# EAGLE design switch_reed (EAGLE 6.6.0)
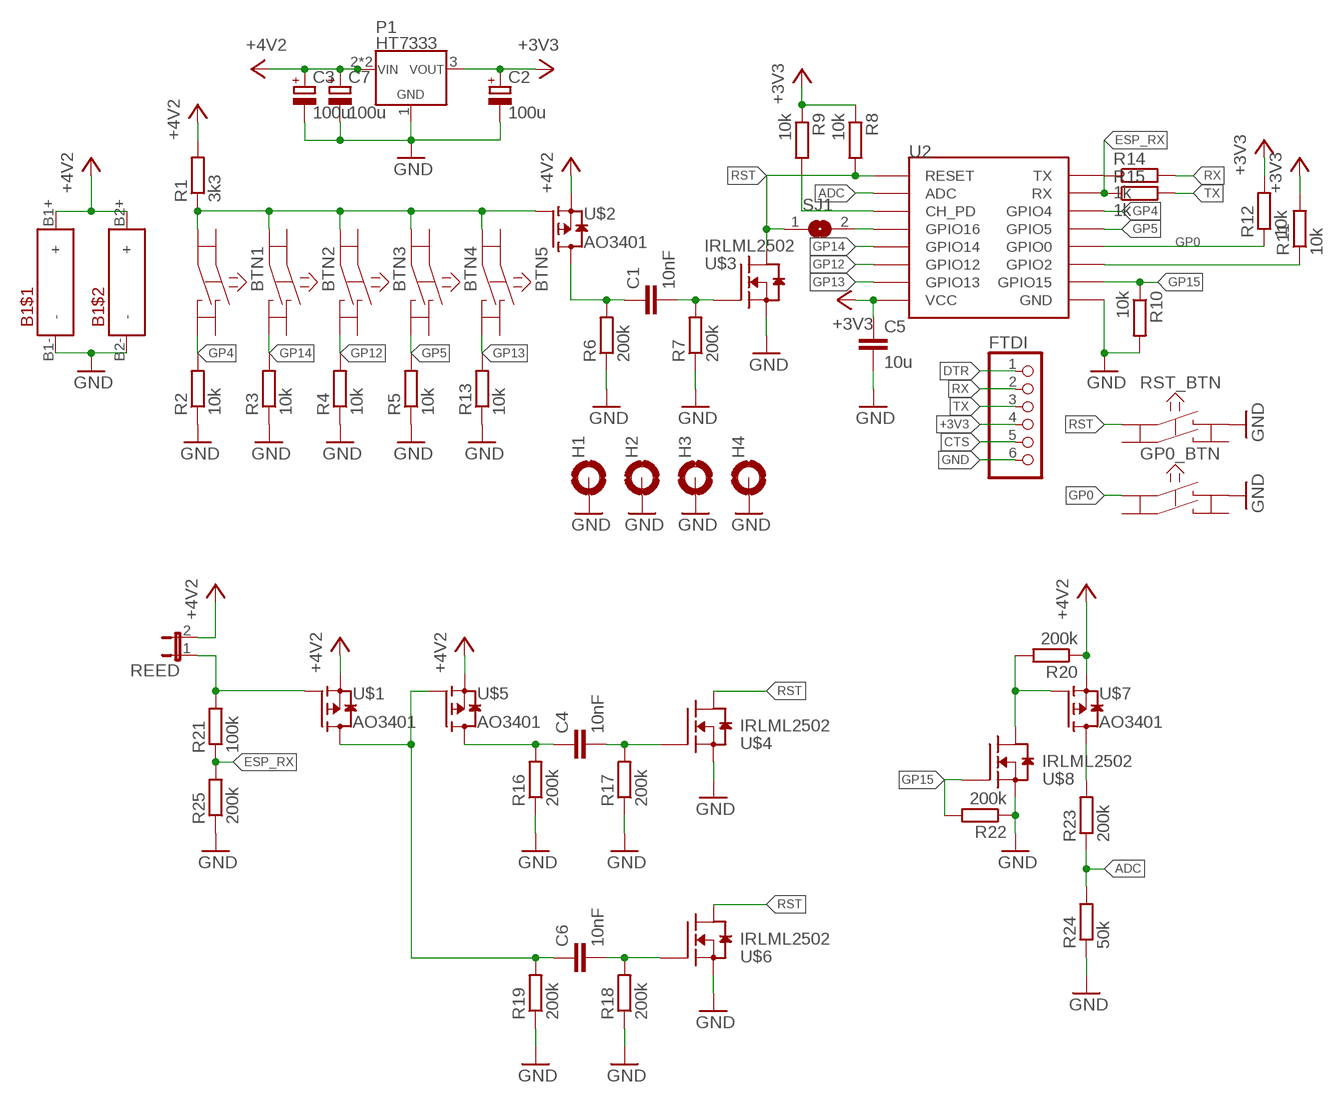
[diagram p0: schematic, sheet 1]

## Parts
B1  18650_2X  [18650_HOLDER]
BTN1  KSM611A  [KSM611A]
BTN2  KSM611A  [KSM611A]
BTN3  KSM611A  [KSM611A]
BTN4  KSM611A  [KSM611A]
BTN5  KSM611A  [KSM611A]
C1  10nF  C-EUC0805  [C0805]
C2  100u  CPOL-EUE5-8.5  [E5-8,5]
C3  100u  CPOL-EUE5-8.5  [E5-8,5]
C4  10nF  C-EUC0805  [C0805]
C5  10u  C-EUC1206  [C1206]
C6  10nF  C-EUC0805  [C0805]
C7  100u  CPOL-EUE5-8.5  [E5-8,5]
FTDI  PINHD-1X06_2.54-S  [1X06-S]
GP0_BTN  KSM611A  [KSM611A]
H1  MOUNT-PAD-ROUND3.2  [3,2-PAD]
H2  MOUNT-PAD-ROUND3.2  [3,2-PAD]
H3  MOUNT-PAD-ROUND3.2  [3,2-PAD]
H4  MOUNT-PAD-ROUND3.2  [3,2-PAD]
P1  HT7333  HT7333SOT89  [SOT89]
R1  3k3  R-EU_R0805  [R0805]
R2  10k  R-EU_R0805  [R0805]
R3  10k  R-EU_R0805  [R0805]
R4  10k  R-EU_R0805  [R0805]
R5  10k  R-EU_R0805  [R0805]
R6  200k  R-EU_R0805  [R0805]
R7  200k  R-EU_R0805  [R0805]
R8  10k  R-EU_R0805  [R0805]
R9  10k  R-EU_R0805  [R0805]
R10  10k  R-EU_R0805  [R0805]
R11  10k  R-EU_R0805  [R0805]
R12  10k  R-EU_R0805  [R0805]
R13  10k  R-EU_R0805  [R0805]
R14  1k  R-EU_R0805  [R0805]
R15  1k  R-EU_R0805  [R0805]
R16  200k  R-EU_R0805  [R0805]
R17  200k  R-EU_R0805  [R0805]
R18  200k  R-EU_R0805  [R0805]
R19  200k  R-EU_R0805  [R0805]
R20  200k  R-EU_R0805  [R0805]
R21  100k  R-EU_R0805  [R0805]
R22  200k  R-EU_R0805  [R0805]
R23  200k  R-EU_R0805  [R0805]
R24  50k  R-EU_R0805  [R0805]
R25  200k  R-EU_R0805  [R0805]
REED  JP1E  [JP1]
RST_BTN  KSM611A  [KSM611A]
SJ1  SJ  [SJ]
U2  ESP12SMD  [ESP12-SMD]
U$1  AO3401  P-CH_AO3401  [SOT23]
U$2  AO3401  P-CH_AO3401  [SOT23]
U$3  IRLML2502  N-CH_IRLML2502  [SOT23]
U$4  IRLML2502  N-CH_IRLML2502  [SOT23]
U$5  AO3401  P-CH_AO3401  [SOT23]
U$6  IRLML2502  N-CH_IRLML2502  [SOT23]
U$7  AO3401  P-CH_AO3401  [SOT23]
U$8  IRLML2502  N-CH_IRLML2502  [SOT23]

## Nets
+3V3: C2.+ C5.1 FTDI.4 P1.3(VOUT) R8.1 R9.1 R11.2 R12.2 U2.VCC
+5V: B1.B1+($1:+) B1.B2+($2:+) C3.+ C7.+ P1.2(VIN) P1.2@1(VIN) R1.2 R20.1 REED.2 U$1.2(S) U$2.2(S) U$5.2(S) U$7.2(S) ; supply symbol labelled +4V2
ADC: R23.1 R24.2 U2.ADC
CTS: FTDI.5
DTR: FTDI.1
ESP_RX: R15.1 R21.1 R25.2 U2.RXD0(RX)
GND: B1.B1-($1:-) B1.B2-($2:-) C2.- C3.- C5.2 C7.- FTDI.6 GP0_BTN.B H1.B3,2(MOUNT) H2.B3,2(MOUNT) H3.B3,2(MOUNT) H4.B3,2(MOUNT) P1.1(GND) R2.1 R3.1 R4.1 R5.1 R6.1 R7.1 R10.2 R13.1 R16.1 R17.1 R18.1 R19.1 R22.1 R24.1 R25.1 RST_BTN.B U2.GND U$3.2(S) U$4.2(S) U$6.2(S) U$8.2(S)
GP0: GP0_BTN.A R12.1 U2.GPIO0
GP4: BTN1.D R2.2 U2.GPIO4
GP5: BTN4.D R5.2 U2.GPIO5
GP12: BTN3.D R4.2 U2.GPIO12
GP13: BTN5.D R13.2 U2.GPIO13
GP14: BTN2.D R3.2 U2.GPIO14
GP15: R10.1 R22.2 U2.GPIO15 U$8.1(G)
N$1: SJ1.2 U2.GPIO16
N$2: R9.2 U2.CH_PD
N$3: C1.2 R7.2 U$3.1(G)
N$5: R11.1 U2.GPIO2
N$6: R14.1 U2.TXD0(TX)
N$7: C1.1 R6.2 U$2.3(D)
N$8: BTN1.C BTN2.C BTN3.C BTN4.C BTN5.C R1.1 U$2.1(G)
N$11: C6.1 R19.2 U$1.3(D) U$5.1(G)
N$12: C4.1 R16.2 U$5.3(D)
N$13: C4.2 R17.2 U$4.1(G)
N$14: C6.2 R18.2 U$6.1(G)
N$16: R20.2 U$7.1(G) U$8.3(D)
N$17: R23.2 U$7.3(D)
N$18: R21.2 REED.1 U$1.1(G)
RST: R8.2 RST_BTN.A SJ1.1 U2.RESET U$3.3(D) U$4.3(D) U$6.3(D)
RX: FTDI.2 R14.2
TX: FTDI.3 R15.2
Unconnected: BTN1.A BTN1.B BTN2.A BTN2.B BTN3.A BTN3.B BTN4.A BTN4.B BTN5.A BTN5.B GP0_BTN.C GP0_BTN.D RST_BTN.C RST_BTN.D

## Library data of the parts
B1 = diyHue:18650_2X
BTN1-BTN5 GP0_BTN RST_BTN = schalter_taster:KSM611A
C1 C4-C6 = rcl:C-EU: CAPACITOR, European symbol
C2 C3 C7 = rcl:CPOL-EU: POLARIZED CAPACITOR, European symbol
FTDI = pinhead-2:PINHD-1X06: PIN HEADER
H1-H4 = holes:MOUNT-PAD-ROUND: MOUNTING PAD, round
P1 = diyHue:HT7333
R1-R25 = rcl:R-EU_: RESISTOR, European symbol
REED = jumper:JP1E: JUMPER
SJ1 = jumper:SJ: SMD solder JUMPER
U2 = esp8266modules:ESP12: ESP8266 Wifi module 12
U$1 U$2 U$5 U$7 = diyHue:P-CH_AO3401
U$3 U$4 U$6 U$8 = diyHue:N-CH_IRLML2502

## Net classes
0 default: width 0.406 mm, drill 0.6 mm

## Board
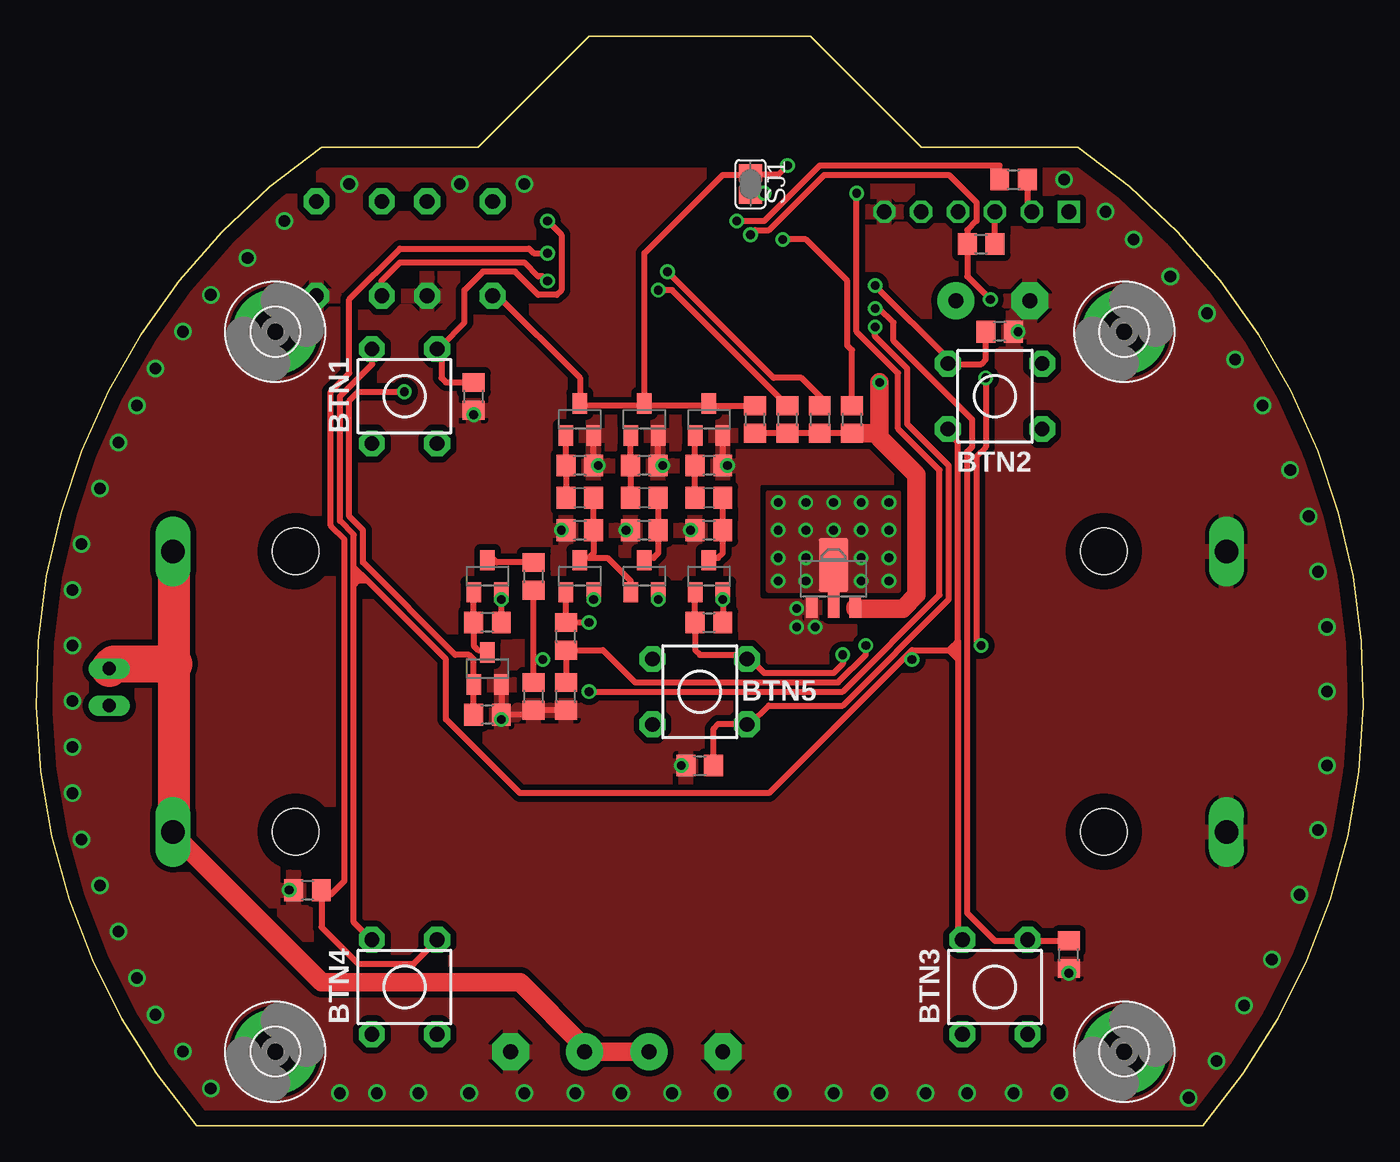
[diagram p1: board, top side]
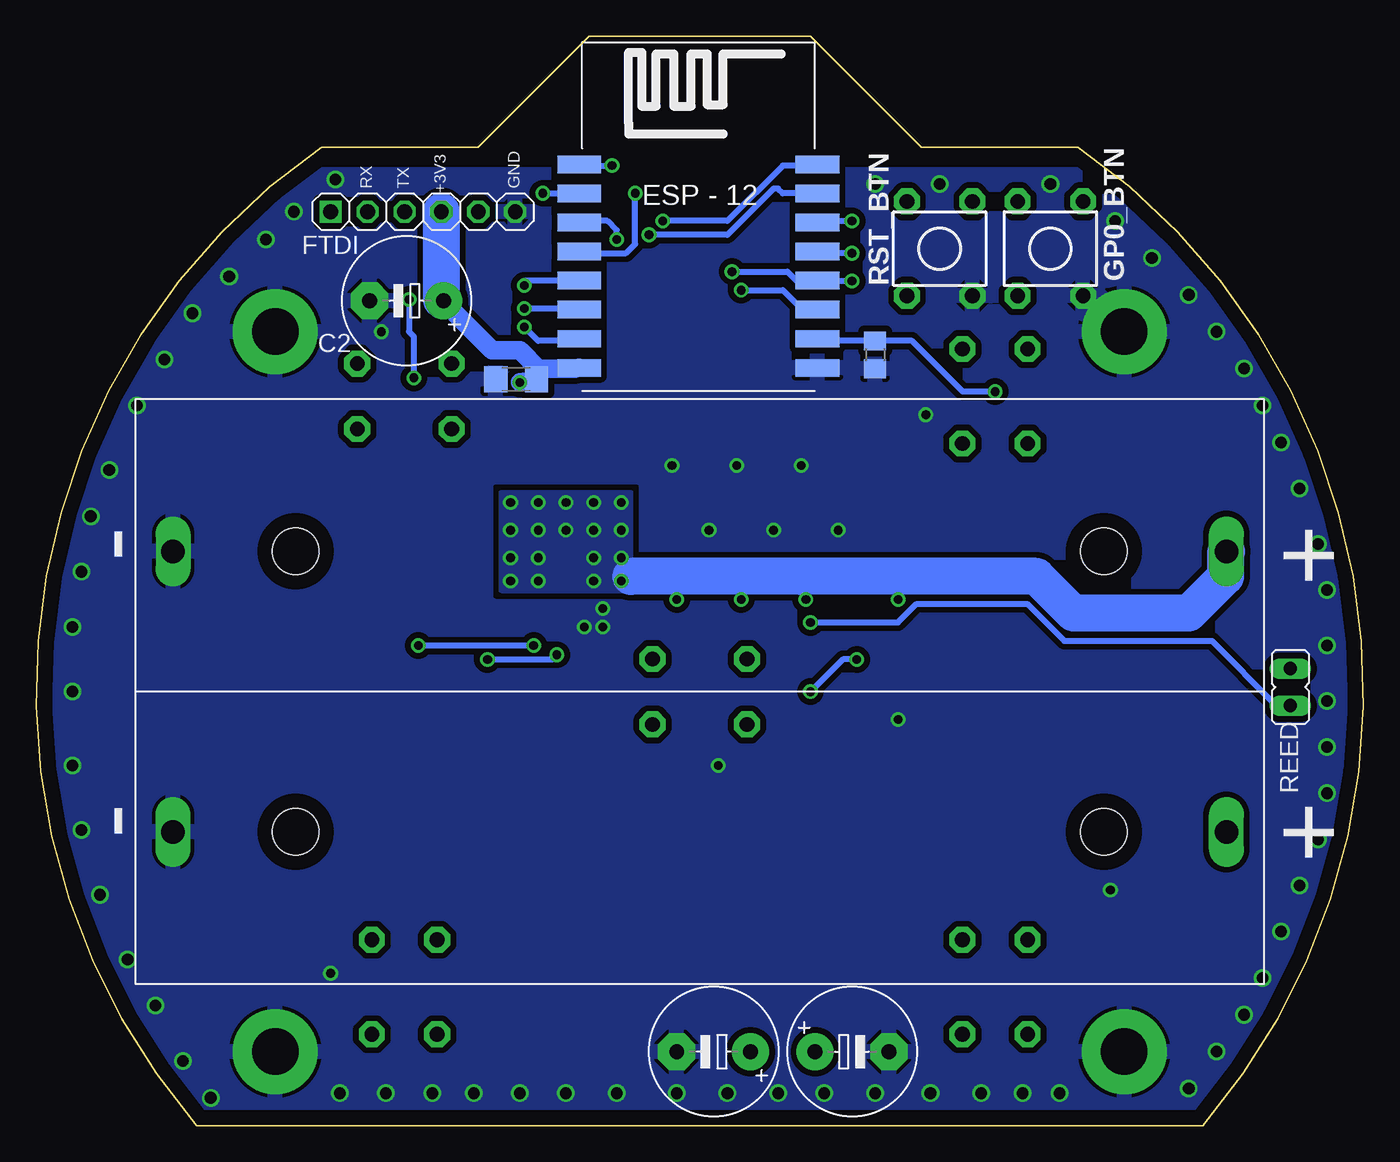
[diagram p2: board, bottom side, seen from below]

Size 91.31 x 74.93 mm. Coordinates in mm from the lower left corner, seen from the top.
Outline: 19.62,67.31 30.42,67.31 38.04,74.93 53.28,74.93 60.9,67.31 71.69,67.31 arc-96 80.27,0 11.05,0 arc-96 19.62,67.31
Copper layers (1*16): Top 0.035mm / dielectric 1.5mm / Bottom 0.035mm
Design rules "default *": minimum track width 10mil, minimum drill 0.5mm, track to track 8mil, track to pad 8mil, pad to pad 8mil, via to via 8mil, smd to smd 0mil, copper to edge 40mil, drill to drill 8mil, minimum pad ring 10mil, minimum via ring 8mil, stop-mask expansion 4mil, vias tented up to drill 50mil, thermal gap 10mil

### Footprints (pad centres in the part's own frame; a part is rotated, then mirrored left to right if it is on the bottom)
18650_HOLDER = drill 1.6 long: B1+ 36.25,9.65; B1- -36.25,9.65; B2+ 36.25,-9.65; B2- -36.25,-9.65 | hole 3.2: -27.81,9.65; 27.81,9.65; 27.81,-9.65; -27.81,-9.65
KSM611A = drill 1.016 pad 1.778 octagon: A -3.25,2.25; B -3.25,-2.25; C 3.25,2.25; D 3.25,-2.25
C0805 = smd 1.3 x 1.5: 1 -0.95,0; 2 0.95,0
E5-8,5 = drill 1.016 pad 2.54: + -2.54,0 | drill 1.016 pad 2.54 octagon: - 2.54,0
C1206 = smd 1.6 x 1.8: 1 -1.4,0; 2 1.4,0
1X06-S = drill 1.016 square: 1 -6.35,0 | drill 1.016 octagon: 2 -3.81,0; 3 -1.27,0; 4 1.27,0; 5 3.81,0; 6 6.35,0
3,2-PAD = drill 3.2 pad 5.842: B3,2 0,0
SOT89 = smd 0.8 x 1.4: 1 -1.499,-1.981; 3 1.499,-1.981 | smd 0.8 x 1.9: 2 0,-1.727 | smd 2.032 x 3.65: 2@1 0,0.94
R0805 = smd 1.3 x 1.5: 1 -0.95,0; 2 0.95,0
JP1 = drill 0.914 long: 1 0,-1.27; 2 0,1.27
SJ = smd 1.168 x 1.6: 1 -0.762,0; 2 0.762,0
ESP12-SMD = smd 3 x 1.2: ADC -8.3,3.8; CH_PD -8.3,1.8; GND 8.1,-8.2; GPIO0 8.1,-2.2; GPIO2 8.1,-4.2; GPIO4 8.1,1.8; GPIO5 8.1,-0.2; GPIO12 -8.3,-4.2; GPIO13 -8.3,-6.2; GPIO14 -8.3,-2.2; GPIO15 8.1,-6.2; GPIO16 -8.3,-0.2; RESET -8.3,5.8; RXD0 8.1,3.8; TXD0 8.1,5.8; VCC -8.3,-8.2
SOT23 = smd 1 x 1.4: 1 -0.95,-1.1; 2 0.95,-1.1; 3 0,1.1

### Placement (x,y rotation side)
B1  45.66,29.84 0 bottom
BTN1  25.34,50.16 90 top
BTN2  65.98,50.16 180 top
BTN3  65.98,9.52 90 top
BTN4  25.34,9.52 90 top
BTN5  45.66,29.84 0 top
C1  46.29,43.18 180 top
C2  65.83,56.74 180 bottom
C3  35.18,5.08 0 bottom
C4  41.85,43.18 180 top
C5  58.29,51.34 180 bottom
C6  37.4,43.18 180 top
C7  44.7,5.08 180 bottom
FTDI  64.71,62.87 0 bottom
GP0_BTN  21.53,60.33 90 bottom
H1  16.45,5.08 0 top
H2  74.87,5.08 0 top
H3  74.87,54.61 0 top
H4  16.45,54.61 0 top
P1  54.86,37.62 0 top
R1  46.29,34.61 0 top
R2  30.1,50.16 90 top
R3  66.29,54.61 180 top
R4  71.06,11.75 90 top
R5  18.67,16.19 0 top
R6  46.29,40.96 0 top
R7  46.29,45.4 180 top
R8  49.47,48.58 90 top
R9  56.13,48.58 90 top
R10  33.59,53.02 270 bottom
R11  51.69,48.58 270 top
R12  53.91,48.58 270 top
R13  45.66,24.77 0 top
R14  67.25,65.09 0 top
R15  65.02,60.64 0 top
R16  41.85,40.96 0 top
R17  41.85,45.4 180 top
R18  37.4,45.4 180 top
R19  37.4,40.96 0 top
R20  31.05,34.61 180 top
R21  36.45,33.66 90 top
R22  31.05,28.26 180 top
R23  34.23,37.78 90 top
R24  34.23,29.53 90 top
R25  36.45,29.53 90 top
REED  5.02,30.16 0 bottom
RST_BTN  29.15,60.33 90 bottom
SJ1  49.15,64.77 270 top
U2  45.66,60.33 0 bottom
U$1  37.4,37.78 0 top
U$2  46.29,37.78 0 top
U$3  46.29,48.58 0 top
U$4  41.85,48.58 0 top
U$5  41.85,37.78 0 top
U$6  37.4,48.58 0 top
U$7  31.05,37.78 0 top
U$8  31.05,31.43 0 top

### Tracks (layer width: path | path; a pad name or v marks a point on that pad's centre or on a via)
+3V3  (via drill 0.6)
  Top 0.406: R11.2 R8.1 | R12.2 R11.2 | R11.2 | R9.1 R12.2 | R12.2
  Top 1.27: R9.1 56.45,47.62 58.04,47.62 | 58.04,47.62 58.04,47.31 60.58,44.77 60.58,36.51 59.63,35.56 56.36,35.56 P1.3 | v58.04,51.12 58.04,47.62
  Bottom 1.27: C2.+ 62.49,55.88 59.94,53.34 58.04,53.34 56.77,52.07 56.77,51.44 C5.1 | U2.VCC 54.23,52.07 56.45,52.07 C5.1 | C5.1 56.89,51.31 v58.04,51.12
  Bottom 2.54: FTDI.4 63.44,56.83 C2.+
+5V  (via drill 0.6)
  Top 0.406: U$7.2 32.01,36.51 v32.01,36.2 R20.1 | v47.24,36.2 47.24,36.51 U$2.2 v47.24,36.2 | v47.24,36.2 R1.2 | U$5.2 v42.8,36.2 | U$1.2 v38.35,36.2
  Top 1.27: C7.+ C3.+ 37.72,5.4 33.27,9.84 19.62,9.84 10.1,19.37 B1.B2+
  Top 2.184: B1.B2+ 9.46,20.95 9.46,31.75 9.46,39.37 B1.B1+
  Top 2.54: 9.46,31.75 5.34,31.75 REED.2
  Bottom 0.406: v42.8,36.2 42.8,37.78 | v38.35,36.2 38.35,37.46 38.67,37.78 | v47.24,36.2 47.24,37.78 | v32.01,36.2 32.01,37.78
  Bottom 2.54: 50.42,37.78 47.24,37.78 42.8,37.78 38.67,37.78 32.01,37.78 22.48,37.78 19.94,35.24 12,35.24 9.46,37.78 9.46,39.37 B1.B1+
  other vias: 52.96,42.86 52.96,40.96 56.77,39.05 56.77,37.46 58.67,42.86 58.67,40.96 58.67,39.05 58.67,37.46 51.05,42.86 51.05,40.96 51.05,39.05 51.05,37.46 52.96,39.05 56.77,40.96 54.86,40.96 52.96,37.46 54.86,42.86 56.77,42.86
  pour Bottom (no thermals): 59.31,36.83 50.42,36.83 50.42,43.5 59.31,43.5
  pour Top (no thermals): 59.31,36.83 50.42,36.83 50.42,43.5 59.31,43.5
ADC  (via drill 0.6)
  Top 0.406: R23.1 34.23,37.15 33.91,36.83 34.23,36.51 34.23,32.07 | 34.23,32.07 34.23,30.8 33.91,30.48 34.23,30.16 R24.2 | v56.45,64.13 56.45,54.61 59.31,51.75 59.31,47.94 62.17,45.09 62.17,36.51 55.5,29.84 v38.04,29.84 | 34.23,32.07 v34.86,32.07
  Bottom 0.406: v56.45,64.13 54.23,64.13 U2.ADC | v38.04,29.84 35.82,32.07 v34.86,32.07
ESP_RX  (via drill 0.6)
  Top 0.406: R15.1 64.07,61.59 64.71,62.23 64.71,63.5 62.8,65.41 54.23,65.41 50.42,61.59 49.47,61.59 v49.15,61.28 | R25.2 36.45,32.38 36.13,32.7 36.45,33.02 R21.1 38.99,32.7 41.21,30.48 55.18,30.48 57.09,32.38 v57.09,33.02 | v65.02,33.02 64.71,33.34 64.71,46.04 65.34,46.67 v65.34,51.44 | v65.66,56.83 64.07,58.42 R15.1 | R15.1
  Bottom 0.406: v49.15,61.28 43.75,61.28 40.58,64.45 40.26,64.45 39.94,64.13 37.72,64.13 U2.RXD0 | v57.09,33.02 v65.02,33.02 | v65.34,51.44 65.34,54.29 65.66,54.61 v65.66,56.83
GND  (via drill 0.6, 0.8)
  Top 0.406: R16.1 v40.58,40.96 | R6.1 v45.02,40.96 | R17.1 v43.12,45.4 | R18.1 v38.67,45.4 | R7.1 v47.56,45.4 | R19.1 v36.13,40.96 | R22.1 v32,27.94 v32.01,27.94 | R25.1 R24.1 34.23,28.26 R22.1 | U$8.2 R22.1 | R13.1 v44.39,24.77 | R3.1 v67.56,54.61 | v71.06,10.48 | R5.1 v17.4,16.19 | R18.1 38.35,47.31 U$6.2 | R18.1 | R17.1 42.8,47.31 U$4.2 | R17.1 | R7.1 47.24,47.31 U$3.2 | R7.1 | R2.1 v30.1,48.89
  Top 0.61: R4.1 v71.06,10.48
  Bottom 0.406: v45.02,40.96 R6.1 | v43.12,45.4 R17.1 | v38.67,45.4 R18.1 | v47.56,45.4 R7.1 | v36.13,40.96 R19.1 | v32.01,27.94 R22.1 | v44.39,24.77 R13.1 | v30.1,48.89 R2.1
  other vias: 17.08,62.23 14.54,59.69 12,57.15 10.1,54.61 8.19,52.07 6.92,49.53 5.65,46.99 4.38,43.81 3.11,40 2.48,36.83 2.48,33.02 2.48,29.21 2.48,26.04 2.48,22.86 3.11,19.68 4.38,16.51 5.65,13.33 6.92,10.16 8.19,7.62 10.1,5.08 12,2.54 81.22,4.45 83.12,8.25 85.03,11.43 86.93,15.87 88.2,20.32 88.84,24.77 88.84,29.84 88.84,34.29 88.2,38.1 87.57,41.91 86.3,45.09 84.39,49.53 82.49,52.7 80.58,55.88 78.04,58.42 75.5,60.96 73.6,62.87 70.74,65.09 33.59,64.77 29.15,64.77 21.53,64.77 20.89,2.22 23.43,2.22 26.29,2.22 29.78,2.22 40.26,2.22 33.59,2.22 37.08,2.22 43.75,2.22 47.24,2.22 51.37,2.22 54.86,2.22 58.04,2.22 61.21,2.22 64.07,2.22 67.25,2.22 70.42,2.22 79.31,1.9 53.59,34.29 52.32,34.29 52.32,35.56
  pour Bottom (isolate 0.406, rank 6): -3.87,65.41 93.92,65.41 93.92,-20.95 -3.87,-20.95
  pour Top (isolate 0.406, rank 6): -3.24,65.41 94.55,65.41 94.55,-20.95 -3.24,-20.95
GP0  (via drill 0.6)
  Top 0.406: v43.43,58.74 50.74,51.44 52.64,51.44 54.23,49.85 54.23,49.53 53.91,49.21 R12.1 | v35.18,58.1 34.86,58.42 34.54,58.42 33.59,59.37 25.02,59.37 23.75,58.1 23.75,57.15 GP0_BTN.A
  Bottom 0.406: v35.18,58.1 37.4,58.1 U2.GPIO0 37.72,58.1 38.99,58.1 39.63,58.74 v43.43,58.74
GP4  (via drill 0.6)
  Top 0.406: v35.18,62.23 36.13,61.28 36.13,57.47 35.82,57.15 34.54,57.15 32.96,58.74 30.74,58.74 29.47,57.47 29.47,55.24 27.88,53.66 BTN1.D 27.88,53.34 27.88,51.44 28.2,51.12 R2.2
  Bottom 0.406: v35.18,62.23 37.4,62.23 U2.GPIO4
GP5  (via drill 0.6)
  Top 0.406: v35.18,60.01 34.23,60.01 33.91,60.33 25.02,60.33 21.53,56.83 21.53,51.75 20.26,50.48 20.26,41.27 21.21,40.32 21.21,16.83 20.26,15.87 19.62,15.87 | 19.62,15.87 19.31,16.19 R5.2 19.62,15.87 | 19.62,15.87 19.62,13.65 22.16,11.11 25.97,11.11 27.56,12.7 BTN4.D
  Bottom 0.406: v35.18,60.01 37.4,60.01 U2.GPIO5
GP12  (via drill 0.6)
  Top 0.406: v57.72,56.2 58.04,56.2 58.99,55.24 58.99,53.97 64.39,48.58 64.39,46.67 64.07,46.36 64.07,14.6 65.98,12.7 68.2,12.7 BTN3.D 68.52,12.7 R4.2
  Bottom 0.406: U2.GPIO12 54.23,56.2 v57.72,56.2
GP13  (via drill 0.6)
  Top 0.406: R13.2 46.61,27.3 46.93,27.62 48.83,27.62 BTN5.D 49.15,27.62 50.42,28.89 55.5,28.89 62.8,36.2 62.8,45.4 59.94,48.26 59.94,52.07 57.72,54.29 v57.72,54.93
  Bottom 0.406: v57.72,54.93 56.77,53.97 54.23,53.97 U2.GPIO13
GP14  (via drill 0.6)
  Top 0.406: R3.2 65.34,52.7 65.02,52.39 62.8,52.39 BTN2.D 62.8,52.7 v57.72,57.78
  Bottom 0.406: U2.GPIO14 54.23,58.1 57.72,58.1 v57.72,57.78
GP15  (via drill 0.6)
  Top 0.406: R22.2 30.1,30.16 U$8.1 30.1,30.48 30.1,32.07 29.78,32.38 28.83,32.38 22.48,38.73 22.48,40.96 21.53,41.91 21.53,49.85 22.16,50.48 v25.34,50.48
  Bottom 0.406: U2.GPIO15 37.4,53.97 34.23,53.97 R10.1 31.05,53.97 27.56,50.48 v25.34,50.48
  Bottom 0.61: 38.04,53.97 U2.GPIO15
N$1  (via drill 0.6)
  Top 0.406: v50.1,64.13 49.15,64.13 SJ1.2
  Bottom 0.406: v50.1,64.13 50.1,60.64 50.74,60.01 53.91,60.01 U2.GPIO16
N$2  (via drill 0.6)
  Top 0.406: R9.2 56.13,53.34 55.82,53.66 55.82,58.1 52.96,60.96 v51.37,60.96
  Bottom 0.406: v51.37,60.96 51.37,61.59 52.01,62.23 53.91,62.23 U2.CH_PD
N$3
  Top 0.406: R7.2 45.34,47.31 U$3.1 | R7.2 C1.2 | R7.2
N$5  (via drill 0.6)
  Top 0.406: v42.8,57.47 43.75,57.47 R11.1
  Bottom 0.406: v42.8,57.47 39.94,57.47 38.67,56.2 37.72,56.2 U2.GPIO2
N$6  (via drill 0.6)
  Top 0.406: R14.1 66.29,66.04 53.91,66.04 50.1,62.23 v48.2,62.23
  Bottom 0.406: v48.2,62.23 43.75,62.23 39.94,66.04 37.72,66.04 U2.TXD0
N$7
  Top 0.406: R6.2 C1.1 | R6.2 47.24,39.37 46.93,39.05 46.29,39.05 U$2.3 | R6.2
N$8  (via drill 0.6)
  Top 0.406: U$2.1 R1.1 45.34,32.7 45.66,32.38 48.83,32.38 BTN5.C 49.15,32.07 50.1,31.11 54.86,31.11 55.5,31.75 v55.5,32.38 | 60.26,32.7 62.8,32.7 | 63.44,32.07 62.8,32.7 | 62.8,32.7 63.12,33.02 | 63.44,33.34 63.44,33.02 | 63.44,33.02 63.12,32.7 63.12,33.02 | 63.12,33.02 63.44,33.34 | v60.26,32.07 60.26,32.7 | 63.44,33.34 63.44,46.99 62.8,47.62 BTN2.C | 21.85,37.15 21.85,13.97 22.8,13.02 BTN4.C | 21.85,38.42 21.85,40.64 20.89,41.59 20.89,50.16 23.11,52.39 23.11,53.34 BTN1.C 22.8,53.34 | 63.44,33.02 63.44,13.02 63.76,12.7 BTN3.C | 22.8,37.46 28.2,32.07 28.2,27.94 33.27,22.86 50.42,22.86 60.26,32.7 | 22.16,37.46 22.16,37.78 21.85,38.1 | 21.85,38.1 21.85,38.42 | 21.85,38.42 22.8,37.46 | 22.8,37.46 22.16,37.46 | 22.16,37.46 21.85,37.15 | 21.85,37.15 21.85,38.1
  Bottom 0.406: v55.5,32.38 55.82,32.07 v60.26,32.07
N$11
  Top 0.406: 38.04,39.05 37.4,39.05 U$1.3 | 38.04,39.05 38.35,39.37 R19.2 | 38.04,39.05 39.31,39.05 40.89,37.46 40.89,36.83 U$5.1 | C6.1 R19.2 | R19.2
N$12
  Top 0.406: R16.2 42.8,39.37 42.48,39.05 41.85,39.05 U$5.3 | R16.2 C4.1 | R16.2
N$13
  Top 0.406: R17.2 C4.2 | R17.2 40.89,47.31 U$4.1 | R17.2
N$14
  Top 0.406: R18.2 C6.2 | R18.2 36.45,47.31 U$6.1 | R18.2
N$16
  Top 0.406: R20.2 30.1,36.51 U$7.1 | R20.2 30.1,33.02 30.42,32.7 31.05,32.7 U$8.3 | R20.2
N$17
  Top 0.406: U$7.3 31.05,39.05 31.37,39.05 31.69,38.73 R23.2
N$18  (via drill 0.6)
  Top 0.406: R21.2 v38.04,34.61 | R21.2 36.45,36.51 U$1.1 | R21.2
  Bottom 0.406: REED.1 5.97,28.89 10.42,33.34 20.58,33.34 23.11,35.88 30.74,35.88 32.01,34.61 v38.04,34.61
RST  (via drill 0.6)
  Top 0.406: 41.85,49.53 37.4,49.53 U$6.3 37.4,51.44 31.69,57.15 RST_BTN.A | 41.85,49.53 U$4.3 41.85,60.01 47.24,65.41 49.15,65.41 | 46.29,49.53 41.85,49.53 | R8.2 46.29,49.53 | 46.29,49.53 U$3.3 | 49.15,65.41 51.05,65.41 v51.69,66.04 | 49.15,65.41 SJ1.1
  Bottom 0.406: v51.69,66.04 53.91,66.04 U2.RESET
RX
  Top 0.406: FTDI.2 68.2,63.18 R14.2
TX
  Top 0.406: FTDI.3 R15.2

### Text on the board
bPlace: GND | TX | RX | +3V3